# EAGLE design WeddingWidget (EAGLE 6.3)
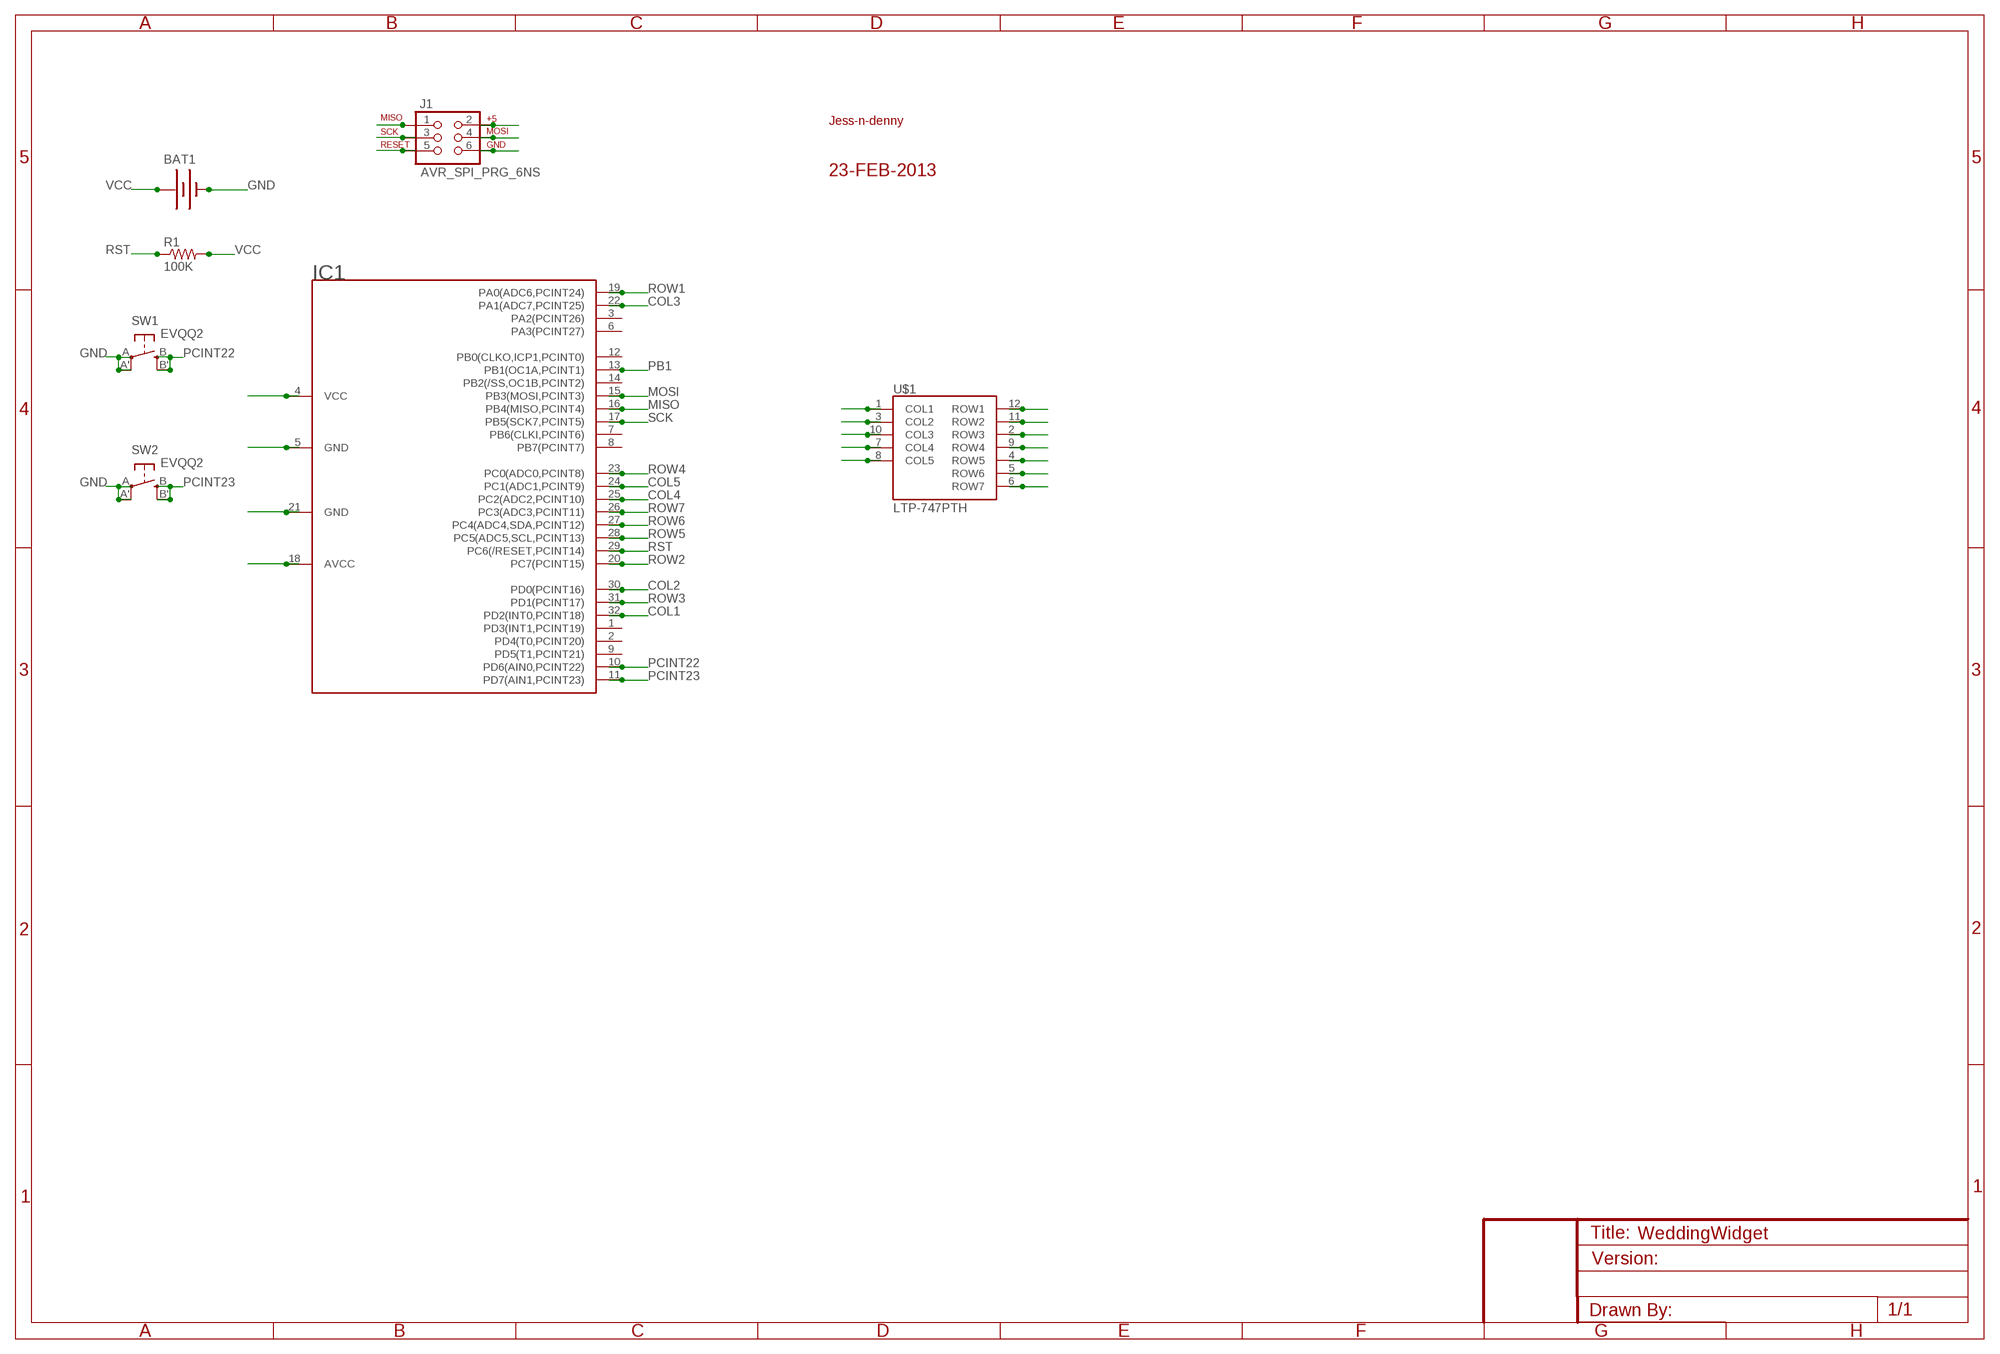
[diagram p0: schematic, sheet 1]

## Parts
BAT1  BATTERY12MM  [BATTCON_12MM]
IC1  ATTINY88  [TQFP32-08]
J1  AVR_SPI_PRG_6NS  [2X3-NS]
R1  100K  R-US_M0805  [M0805]
SW1  EVQQ2  [EVQ-Q2]
SW2  EVQQ2  [EVQ-Q2]
U$1  LTP-747PTH  [LTP-747]
U$2  JESS-N-DENNY  [JESS-N-DENNY]
U$3  23FEB2013  [23FEB2013]

## Nets
COL1: IC1.32(PD2(INT0,PCINT18)) U$1.1(COL1)
COL2: IC1.30(PD0(PCINT16)) U$1.3(COL2)
COL3: IC1.22(PA1(ADC7,PCINT25)) U$1.10(COL3)
COL4: IC1.25(PC2(ADC2,PCINT10)) U$1.7(COL4)
COL5: IC1.24(PC1(ADC1,PCINT9)) U$1.8(COL5)
GND: BAT1.GND(-) IC1.5(GND) IC1.21(GND) J1.6 SW1.A'(P1) SW1.A(P) SW2.A'(P1) SW2.A(P)
MISO: IC1.16(PB4(MISO,PCINT4)) J1.1
MOSI: IC1.15(PB3(MOSI,PCINT3)) J1.4
PB1: IC1.13(PB1(OC1A,PCINT1))
PCINT22: IC1.10(PD6(AIN0,PCINT22)) SW1.B'(S1) SW1.B(S)
PCINT23: IC1.11(PD7(AIN1,PCINT23)) SW2.B'(S1) SW2.B(S)
ROW1: IC1.19(PA0(ADC6,PCINT24)) U$1.12(ROW1)
ROW2: IC1.20(PC7(PCINT15)) U$1.11(ROW2)
ROW3: IC1.31(PD1(PCINT17)) U$1.2(ROW3)
ROW4: IC1.23(PC0(ADC0,PCINT8)) U$1.9(ROW4)
ROW5: IC1.28(PC5(ADC5,SCL,PCINT13)) U$1.4(ROW5)
ROW6: IC1.27(PC4(ADC4,SDA,PCINT12)) U$1.5(ROW6)
ROW7: IC1.26(PC3(ADC3,PCINT11)) U$1.6(ROW7)
RST: IC1.29(PC6(/RESET,PCINT14)) J1.5 R1.1
SCK: IC1.17(PB5(SCK7,PCINT5)) J1.3
VCC: BAT1.V+(+) IC1.4(VCC) IC1.18(AVCC) J1.2 R1.2
Unconnected: IC1.1(PD3(INT1,PCINT19)) IC1.2(PD4(T0,PCINT20)) IC1.3(PA2(PCINT26)) IC1.6(PA3(PCINT27)) IC1.7(PB6(CLKI,PCINT6)) IC1.8(PB7(PCINT7)) IC1.9(PD5(T1,PCINT21)) IC1.12(PB0(CLKO,ICP1,PCINT0)) IC1.14(PB2(/SS,OC1B,PCINT2))

## Library data of the parts
BAT1 = rxtx-labs:BATTERY: Battery Holders Various common sizes : AA, AAA, 20mm coin cell and 12mm coin cell.
IC1 = attiny88:ATTINY88
J1 = SparkFun:AVR_SPI_PRG_6: AVR ISP 6 Pin This is the reduced ISP connector for AVR programming. Common on Arduino. This footprint will take up less PCB space and can be used with a 10-pin to 6-pin adapter such as SKU: BOB-08508
R1 = adafruit:R-US_: RESISTOR, American symbol
SW1 SW2 = adafruit:EVQQ2: SMT 6mm switch, EVQQ2 series http://www.ladyada.net/library/eagle
U$1 = LiteOn-LED-Matrix:LTP-747: Jameco Part #2005454
U$2 = rxtx-labs:JESS-N-DENNY
U$3 = rxtx-labs:23FEB2013

## Board
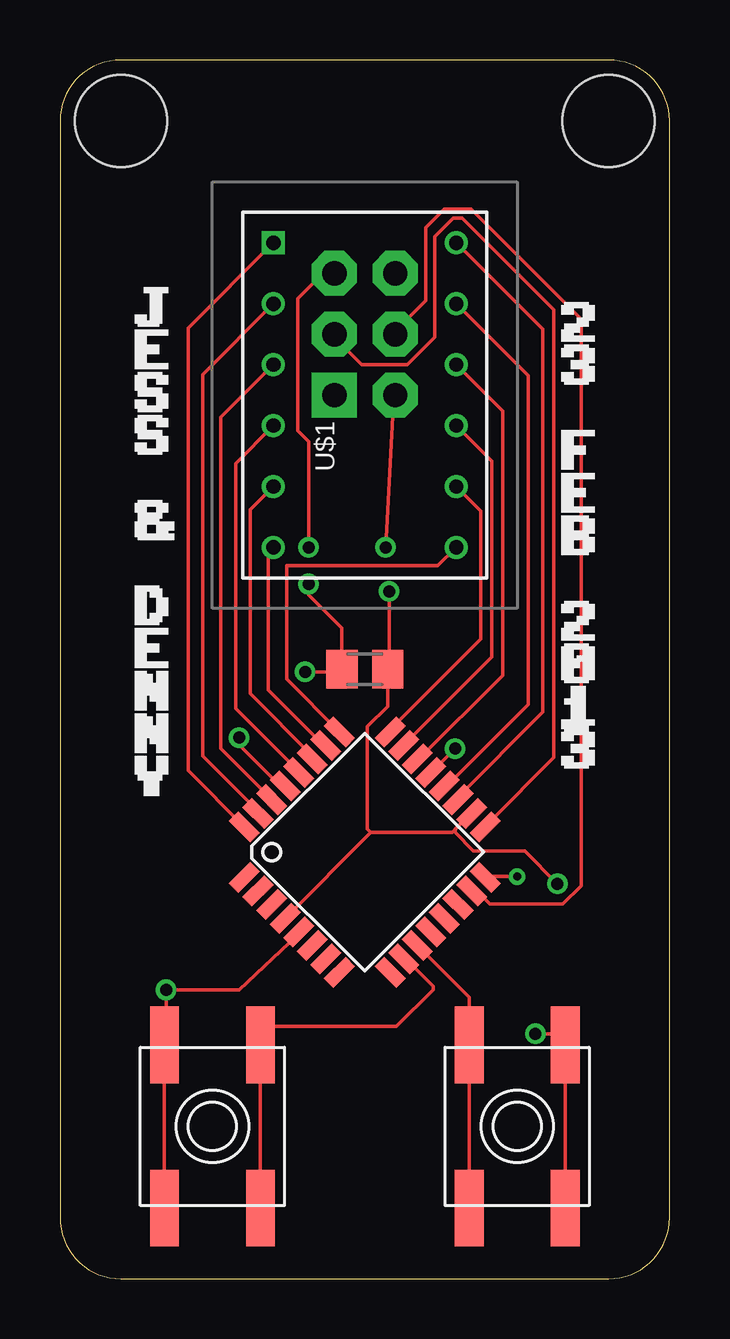
[diagram p1: board, top side]
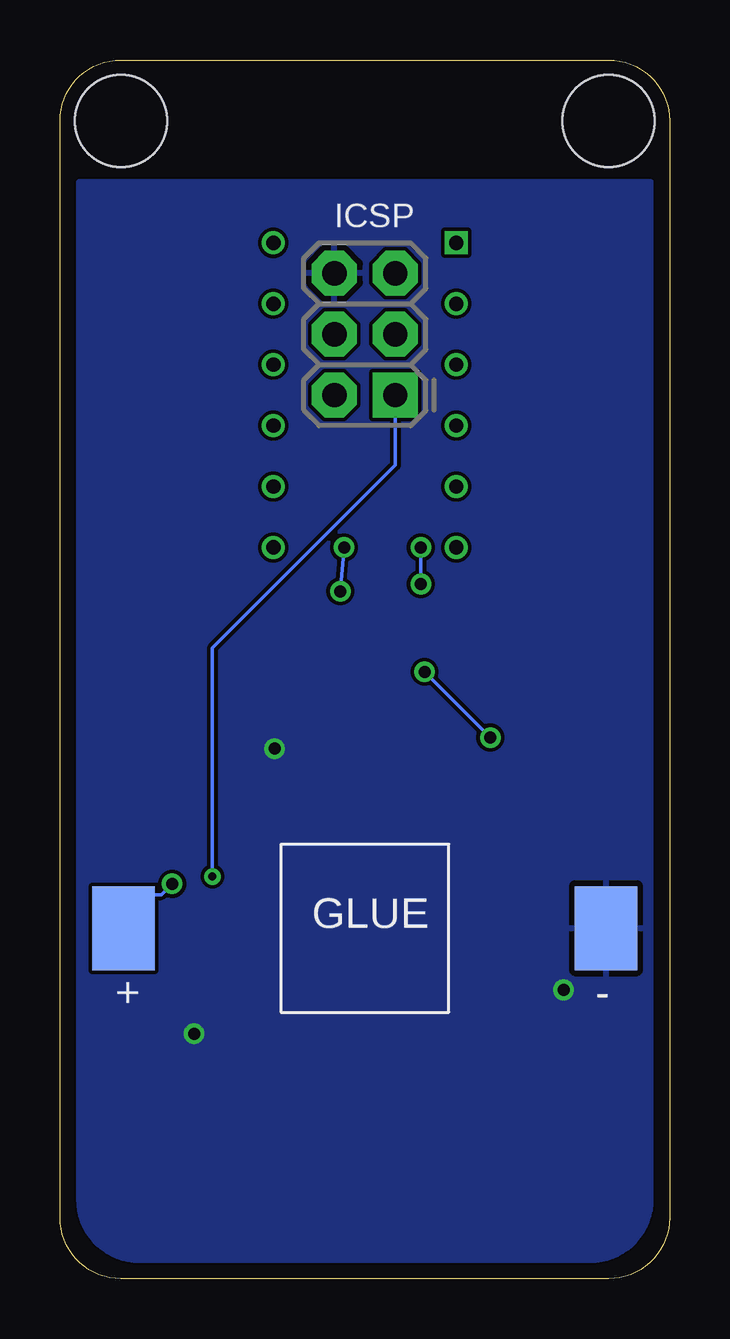
[diagram p2: board, bottom side, seen from below]

Size 25.4 x 50.8 mm. Coordinates in mm from the lower left corner, seen from the top.
Outline: 22.86,50.8 2.54,50.8 arc90 0,48.26 0,2.54 arc90 2.54,0 22.86,0 arc90 25.4,2.54 25.4,48.26 arc90 22.86,50.8
Copper layers (1*16): Top 0.0356mm / dielectric 1.5011mm / Bottom 0.0356mm
Design rules "LaenPCBOrder": minimum track width 6mil, minimum drill 13mil, track to track 6mil, track to pad 6mil, pad to pad 6mil, via to via 6mil, smd to smd 6mil, copper to edge 15mil, drill to drill 6mil, minimum pad ring 7mil, minimum via ring 7mil, stop-mask expansion 4mil, vias tented up to drill 0mil, thermal gap 10mil
Holes 3.84 mm at 2.54,48.26 22.86,48.26

### Footprints (pad centres in the part's own frame; a part is rotated, then mirrored left to right if it is on the bottom)
BATTCON_12MM = smd 2.6 x 3.5: GND 10.05,0; V+ -10.05,0
TQFP32-08 = smd 1.27 x 0.559: 1 -4.293,2.8; 2 -4.293,2; 3 -4.293,1.2; 4 -4.293,0.4; 5 -4.293,-0.4; 6 -4.293,-1.2; 7 -4.293,-2; 8 -4.293,-2.8; 17 4.293,-2.8; 18 4.293,-2; 19 4.293,-1.2; 20 4.293,-0.4; 21 4.293,0.4; 22 4.293,1.2; 23 4.293,2; 24 4.293,2.8 | smd 0.559 x 1.27: 9 -2.8,-4.293; 10 -2,-4.293; 11 -1.2,-4.293; 12 -0.4,-4.293; 13 0.4,-4.293; 14 1.2,-4.293; 15 2,-4.293; 16 2.8,-4.293; 25 2.8,4.293; 26 2,4.293; 27 1.2,4.293; 28 0.4,4.293; 29 -0.4,4.293; 30 -1.2,4.293; 31 -2,4.293; 32 -2.8,4.293
2X3-NS = drill 1.016 pad 1.88 square: 1 -2.54,-1.27 | drill 1.016 pad 1.88 octagon: 2 -2.54,1.27; 3 0,-1.27; 4 0,1.27; 5 2.54,-1.27; 6 2.54,1.27
M0805 = smd 1.3 x 1.6: 1 -0.95,0; 2 0.95,0
EVQ-Q2 = smd 3.2 x 1.2: A -3.4,-2; A' 3.4,-2; B -3.4,2; B' 3.4,2
LTP-747 = drill 0.6 square: 1 -3.81,6.35 | drill 0.6: 2 -3.81,3.81; 3 -3.81,1.27; 4 -3.81,-1.27; 5 -3.81,-3.81; 6 -3.81,-6.35; 7 3.81,-6.35; 8 3.81,-3.81; 9 3.81,-1.27; 10 3.81,1.27; 11 3.81,3.81; 12 3.81,6.35

### Placement (x,y rotation side)
BAT1  12.7,14.61 0 bottom
IC1  12.7,17.78 45 top
J1  12.7,39.37 90 bottom
R1  12.7,25.4 0 top
SW1  6.35,6.35 270 top
SW2  19.05,6.35 90 top
U$1  12.7,36.83 0 top
U$2  3.81,20.32 0 top
U$3  21.59,21.59 0 top

### Tracks (layer width: path | path; a pad name or v marks a point on that pad's centre or on a via)
COL1
  Top 0.152: IC1.32 5.33,21.18 5.33,39.62 U$1.1
COL2
  Top 0.152: IC1.30 8.82,19.99 6.71,22.1 6.71,35.92 U$1.3
COL3
  Top 0.152: IC1.22 14.96,21.66 18.44,25.15 18.44,36.17 U$1.10
COL4
  Top 0.152: IC1.25 9.45,24.99 9.45,29.72 15.75,29.72 U$1.7
COL5
  Top 0.152: IC1.24 13.76,22.9 17.53,26.67 17.53,32 U$1.8
GND  (via drill 0.5)
  Top 0.152: SW1.A' SW1.A 4.42,9.75 v4.42,12.04 7.47,12.04 9.91,14.33 IC1.5 | SW2.A SW2.A' 21.03,9.75 21.03,10.21 v19.81,10.21 | v16.46,22.1 15.54,21.18 IC1.21
  pour Bottom: 0.76,45.72 24.64,45.72 24.64,3.3 arc-90 22.1,0.76 3.3,0.76 arc-90 0.76,3.3
MISO  (via drill 0.33)
  Top 0.152: v19.05,16.76 17.91,16.76 IC1.16
  Bottom 0.152: v19.05,16.76 19.05,26.29 11.43,33.91 J1.1
MOSI
  Top 0.152: IC1.15 17.53,16 17.91,15.62 20.95,15.62 21.72,16.38 21.72,40.01 17.14,44.58 16,44.58 15.24,43.81 15.24,40.77 14.1,39.62 J1.4
PCINT22
  Top 0.152: SW1.B' SW1.B 8.38,9.78 8.38,10.36 8.53,10.52 14.02,10.52 15.54,12.04 15.54,12.19 14.41,13.33 IC1.10
PCINT23
  Top 0.152: IC1.11 17.05,11.73 SW2.B' SW2.B
ROW1
  Top 0.152: IC1.19 16.58,20.09 20.12,23.62 20.12,39.57 U$1.12
ROW2
  Top 0.152: IC1.20 16.11,20.53 19.51,23.93 19.51,37.64 U$1.11
ROW3
  Top 0.152: IC1.31 8.25,19.49 5.94,21.79 5.94,37.69 U$1.2
ROW4
  Top 0.152: IC1.23 14.32,22.25 17.98,25.91 17.98,34.09 U$1.9
ROW5
  Top 0.152: IC1.28 9.95,21.14 7.32,23.77 7.32,33.98 U$1.4
ROW6
  Top 0.152: IC1.27 10.51,21.8 7.92,24.38 7.92,32.05 U$1.5
ROW7
  Top 0.152: IC1.26 10.99,22.23 8.69,24.54 8.69,30.28 U$1.6
RST  (via drill 0.5)
  Top 0.152: v10.21,25.3 11.58,25.3 11.73,25.15 11.89,25.3 R1.1 11.73,25.45 11.73,27.13 10.36,28.5 v10.36,28.96 | v7.47,22.55 7.47,22.25 9.3,20.42 IC1.29 | v10.36,30.48 10.36,34.9 9.91,35.36 9.91,40.84 10.97,41.91 J1.5
  Bottom 0.152: v10.21,25.3 v7.47,22.55 | v10.36,30.48 v10.36,28.96
SCK
  Top 0.152: IC1.17 17.91,19.05 20.57,21.72 20.57,40.39 16.76,44.2 16.38,44.2 15.62,43.43 15.62,39.24 14.48,38.1 12.57,38.1 11.43,39.24 J1.3
VCC  (via drill 0.5)
  Top 0.152: v20.73,16.46 19.36,17.83 17.22,17.83 16.46,18.59 16.46,18.75 17.07,19.36 IC1.18 16.34,18.59 12.95,18.59 | IC1.4 12.95,18.59 | 12.95,18.59 12.8,18.75 12.8,23.01 13.65,23.86 R1.2 13.72,25.45 v13.72,28.65 | v13.56,30.48 13.87,35.97 13.87,36.73 J1.2
  Bottom 0.152: v20.73,16.46 21.18,16 22.55,16 22.71,15.85 22.71,14.63 BAT1.V+ | v13.72,28.65 v13.56,30.48

### Text on the board
bPlace: ICSP